# EAGLE design placa_eagle_1 (1) (EAGLE 9.1.3)
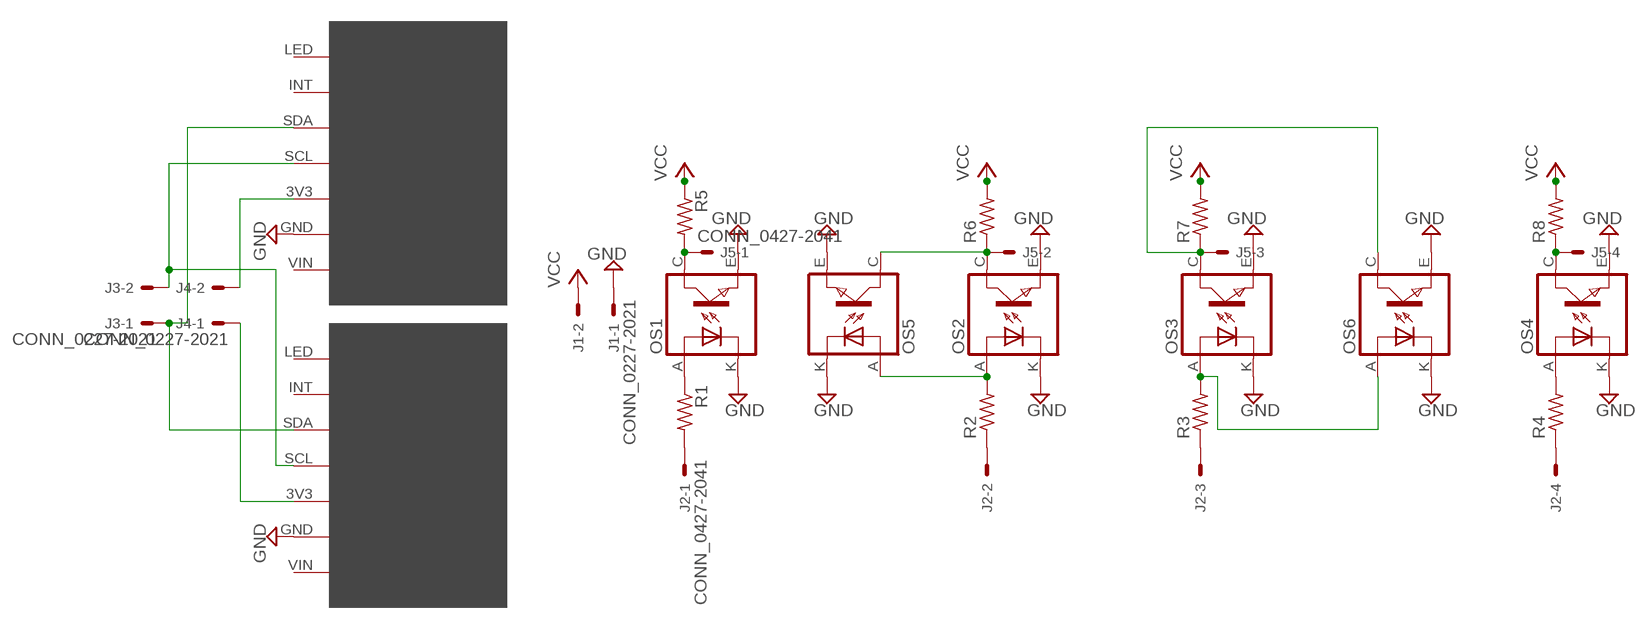
[diagram p0: schematic, sheet 1]

## Parts
J1  CONN_0227-2021  [6410-02]
J2  CONN_0427-2041  [6410-04]
J3  CONN_0227-2021  [6410-02]
J4  CONN_0227-2021  [6410-02]
J5  CONN_0427-2041  [6410-04]
OS1  TCRT5000  [TCRT5000]
OS2  TCRT5000  [TCRT5000]
OS3  TCRT5000  [TCRT5000]
OS4  TCRT5000  [TCRT5000]
OS5  TCRT5000  [TCRT5000]
OS6  TCRT5000  [TCRT5000]
R1  R-US_0204/7  [0204/7]
R2  R-US_0204/7  [0204/7]
R3  R-US_0204/7  [0204/7]
R4  R-US_0204/7  [0204/7]
R5  R-US_0204/7  [0204/7]
R6  R-US_0204/7  [0204/7]
R7  R-US_0204/7  [0204/7]
R8  R-US_0204/7  [0204/7]
TCS1  TCS34725  [TCS34725]
TCS2  TCS34725  [TCS34725]

## Nets
GND: J1.1 OS1.E(EMITTER) OS1.K(CATHODE) OS2.E(EMITTER) OS2.K(CATHODE) OS3.E(EMITTER) OS3.K(CATHODE) OS4.E(EMITTER) OS4.K(CATHODE) OS5.E(EMITTER) OS5.K(CATHODE) OS6.E(EMITTER) OS6.K(CATHODE) TCS1.GND TCS2.GND
N$1: OS1.A(ANODE) R1.1
N$4: OS4.A(ANODE) R4.2
N$5: J5.1 OS1.C(COLLECTOR) R5.2
N$8: J5.4 OS4.C(COLLECTOR) R8.1
N$9: J2.1 R1.2
N$10: J2.2 R2.1
N$11: J2.3 R3.1
N$12: J2.4 R4.1
N$13: J4.2 TCS1.3V3
N$14: J4.1 TCS2.3V3
N$15: OS2.A(ANODE) OS5.A(ANODE) R2.2
N$16: J3.1 TCS1.SDA TCS2.SDA
N$17: J5.2 OS2.C(COLLECTOR) OS5.C(COLLECTOR) R6.1
N$18: J3.2 TCS1.SCL TCS2.SCL
N$19: OS3.A(ANODE) OS6.A(ANODE) R3.2
N$20: J5.3 OS3.C(COLLECTOR) OS6.C(COLLECTOR) R7.1
VCC: J1.2 R5.1 R6.2 R7.2 R8.2
Unconnected: TCS1.INT TCS1.LED TCS1.VIN TCS2.INT TCS2.LED TCS2.VIN

## Library data of the parts
J1 J3 J4 = Robotica-IFRN-SC-conectores:CONN_02: CONNECTOR wire to board 2.54 mm (.1 inch) pitch header; OC_FARNELL: unknown; OC_NEWARK: unknown
J2 J5 = Robotica-IFRN-SC-conectores:CONN_04: CONNECTOR wire to board 2.54 mm (.1 inch) pitch header; OC_FARNELL: unknown; OC_NEWARK: unknown
OS1-OS6 = Robotica-IFRN-SC-sensores:TCRT5000
R1-R8 = rcl:R-US_: RESISTOR, American symbol
TCS1 TCS2 = Robotica-IFRN-SC-sensores:TCS34725: Sensor de cor TCS34725

## Board
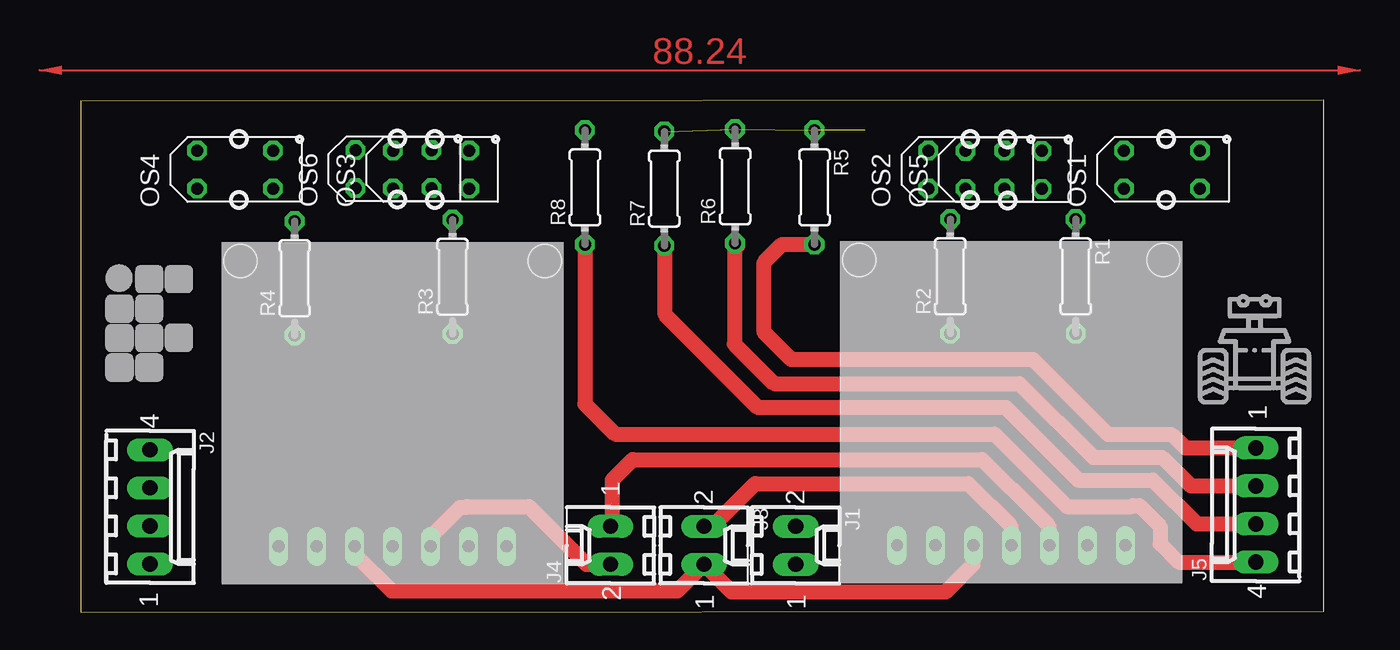
[diagram p1: board, top side]
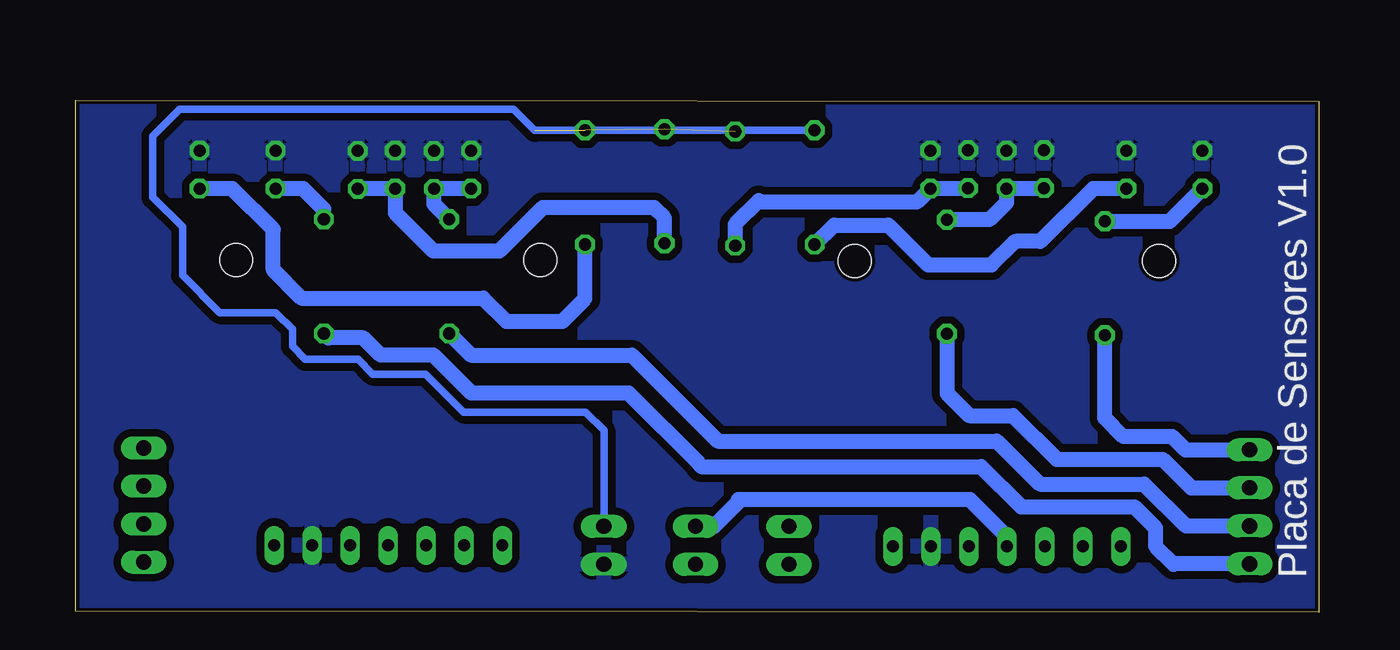
[diagram p2: board, bottom side, seen from below]

Size 83.03 x 34.2 mm. Coordinates in mm from the lower left corner, seen from the top.
Outline: 0,0 83.03,0.08 83.03,34.2 0,34.13 0,0
Copper layers (1*16): Top 0.035mm / dielectric 1.5mm / Bottom 0.035mm
Design rules "default *": minimum track width 10mil, minimum drill 0.35mm, track to track 20mil, track to pad 20mil, pad to pad 20mil, via to via 20mil, smd to smd 6mil, copper to edge 10mil, drill to drill 6mil, minimum pad ring 10mil, minimum via ring 8mil, stop-mask expansion 4mil, vias tented up to drill 0mil, thermal gap 10mil

### Footprints (pad centres in the part's own frame; a part is rotated, then mirrored left to right if it is on the bottom)
6410-02 = drill 1.016 long: 1 1.27,0; 2 -1.27,0
6410-04 = drill 1.016 long: 1 3.81,0; 2 1.27,0; 3 -1.27,0; 4 -3.81,0
TCRT5000 = drill 0.8 octagon: A -2.54,-1.27; C 2.54,-1.27; E 2.54,1.27; K -2.54,1.27
0204/7 = drill 0.813 octagon: 1 -3.81,0; 2 3.81,0
TCS34725 = drill 0.8 long: 3V3 0,-5.08; GND 2.54,-5.08; INT -7.62,-5.08; LED -10.16,-5.08; SCL -2.54,-5.08; SDA -5.08,-5.08; VIN 5.08,-5.08 | hole 2.2: -12.7,13.97; 7.62,13.97

### Placement (x,y rotation side)
J1  47.76,4.47 270 top
J2  4.62,7.03 270 top
J3  41.64,4.47 270 top
J4  35.39,4.47 90 top
J5  78.5,7.16 90 top
OS1  72.24,29.57 0 top
OS2  59.16,29.57 0 top
OS3  23.4,29.57 0 top
OS4  10.31,29.57 0 top
OS5  61.65,29.54 0 top
OS6  20.89,29.59 0 top
R1  66.47,22.43 270 top
R2  58.09,22.43 90 top
R3  24.84,22.4 90 top
R4  14.29,22.3 90 top
R5  49.02,28.37 270 top
R6  43.71,28.45 90 top
R7  38.98,28.3 90 top
R8  33.68,28.37 90 top
TCS1  23.38,9.47 0 top
TCS2  64.7,9.55 0 top

### Tracks (layer width: path | path; a pad name or v marks a point on that pad's centre or on a via)
GND
  pour Bottom: 0.01,34.32 83.17,34.32 83.17,0.03 0.01,0.03
N$1
  Bottom 1.016: OS1.A 67.84,28.3 66.47,26.92 R1.1
N$4
  Bottom 1.016: R4.2 9.95,26.11 OS4.A
N$5
  Top 1.016: J5.1 73.79,10.97 72.89,11.87 68.63,11.87 63.61,16.89 47.45,16.89 45.65,18.69 45.65,23.37 46.85,24.56 R5.2
  Bottom 1.016: R5.2 49.02,20.94 50.53,19.43 54.26,19.43 55.81,20.98 67.97,20.98 69.85,22.86 69.85,25.57 72.57,28.3 OS1.C
N$8
  Top 1.016: R8.1 33.68,13.9 35.69,11.89 61.07,11.89 65.91,7.05 70.25,7.05 70.31,7.11 70.75,7.11 72.12,5.74 72.12,4.57 73.34,3.35 J5.4
  Bottom 1.016: R8.1 32.38,25.86 28.76,25.86 26.09,23.19 21.85,23.19 20.28,24.77 18.6,24.77 15.07,28.3 OS4.C
N$9
  Bottom 1.016: R1.2 66.18,18.33 63.83,18.33 62.67,17.17 59.14,17.17 56.6,14.63 46.11,14.63 41.38,9.91 41.38,9.86 41.26,9.73 22.56,9.73 19.87,7.04 12.3,7.04 10.9,5.64 10.9,4.42 9.69,3.2 9.66,3.22 J2.1
N$10
  Bottom 1.016: R2.1 56.64,17.17 45.88,17.17 40.14,11.43 21.5,11.43 18.63,8.56 11.67,8.56 8.88,5.76 J2.2
N$11
  Bottom 1.016: R3.1 24.84,14.62 23.35,13.13 20.43,13.13 17.51,10.21 10.42,10.21 8.52,8.3 J2.3
N$12
  Bottom 1.016: R4.1 14.29,12.97 13.05,11.73 9.79,11.73 8.9,10.84 J2.4
N$13
  Top 1.016: TCS1.3V3 23.38,5.05 25.33,7.01 25.77,7.01 25.8,7.05 29.94,7.05 33.79,3.2 J4.2
N$14
  Top 1.016: TCS2.3V3 64.7,5.74 62.16,8.28 62.14,8.28 60.23,10.19 36.86,10.19 35.52,8.84 35.52,5.87 J4.1 35.57,5.74
N$15
  Bottom 1.016: OS2.A 56.65,28.27 OS5.A 59.11,27.26 R2.2
N$16
  Top 1.016: TCS1.SDA 18.3,3.89 20.76,1.42 39.86,1.42 J3.1 43.49,1.35 57.77,1.35 59.62,3.2 TCS2.SDA
N$17
  Top 1.016: J5.2 74.17,8.43 72.25,10.35 67.63,10.35 62.72,15.27 46.31,15.27 43.67,17.91 43.67,24.6 R6.1 43.89,24.46
  Bottom 1.016: R6.1 43.71,26.33 44.41,27.03 51.85,27.03 54.74,24.13 59.16,24.13 61.7,26.67 OS2.C | 61.76,28.35 OS2.C | OS2.C 61.73,28.27 OS5.C
N$18
  Top 1.016: TCS2.SCL 62.16,5.74 59.32,8.59 45.04,8.59 42.2,5.74 J3.2
  Bottom 1.016: TCS1.SCL 20.84,5.05 23.3,7.52 38.62,7.52 | 38.62,7.52 38.79,7.52 | 38.62,7.52 40.39,5.74 J3.2
N$19
  Bottom 1.016: OS6.A 18.37,28.3 OS3.A 20.86,27.36 22,26.21 R3.2
N$20
  Top 1.016: J5.3 74.56,5.89 71.62,8.83 66.64,8.83 61.81,13.67 45.25,13.67 39.03,19.88 39.03,24.43 R7.1
  Bottom 1.016: 31.96,27.38 26.86,27.38 OS3.C 23.45,28.3 OS6.C | 31.96,27.38 35.16,27.38 | 35.16,27.38 37.29,27.38 37.4,27.48 38.98,25.9 R7.1 | 35.16,27.38 | 31.96,27.38
VCC  (3 unrouted)
  Bottom 0.508: R8.2 52.38,32.18 53.8,33.6 76.08,33.6 77.88,31.8 77.88,27.71 75.9,25.73 75.9,22.5 73.41,20.02 69.68,20.02 68.56,18.9 68.56,17.75 67.7,16.89 64.19,16.89 63.2,15.9 59.67,15.9 57.13,13.36 48.98,13.36 47.76,12.14 J1.2
(copper drawn outside any net)
  shapes: Top area x1

### Text on the board
tPlace: C:/google escolar/PC IFRN/Documentos/software e placas/placas/placa shield/logo IF.bmp
bPlace: Placa de Sensores V1.0